# Altium schematic sheet Section B - TItle B.SchDoc
size 350 x 229 mm
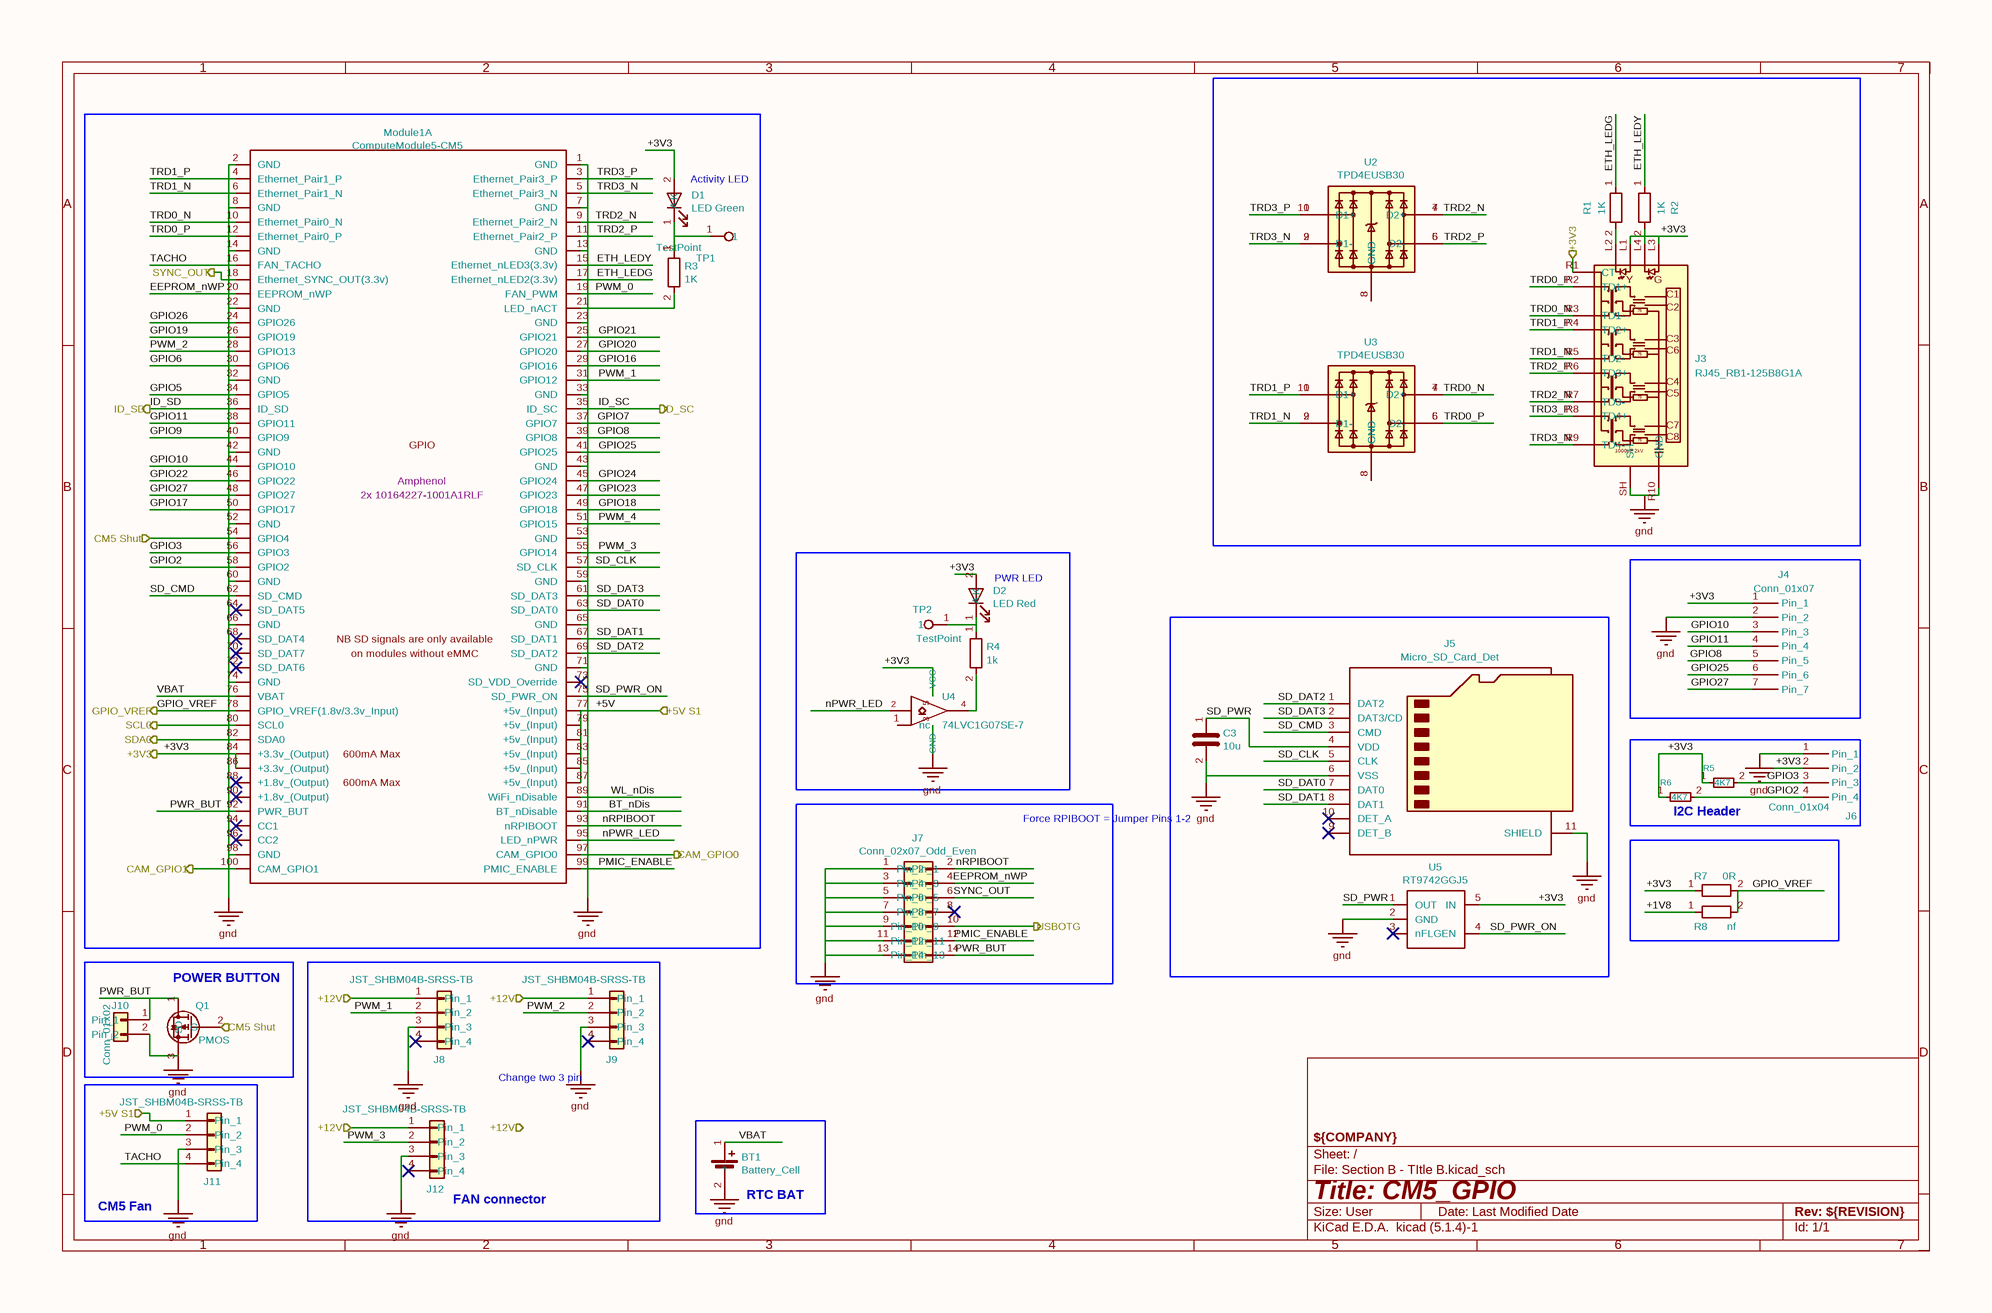
[diagram p0: Section B - TItle B.SchDoc]

## Parts
BT1  Battery_Cell  [BatteryHolder_Keystone_3034_1x20mm]
C3  10u  [C_0805_2012Metric]
D1  LED Green  [LED_0603_1608Metric]
D2  LED Red  [LED_0603_1608Metric]
J3  RJ45_RB1-125B8G1A  [RJ45_UDE_RB1-125B8G1A]
J4  Conn_01x07  [JST_GH_SM07B-GHS-TB_1x07-1MP_P1.25mm_Horizontal]
J5  Micro_SD_Card_Det  [DM3ATSFPEJM5]
J6  Conn_01x04  [SPARKFUN_PRT-14417]
J7  Conn_02x07_Odd_Even  [PinHeader_2x07_P2.54mm_Vertical]
J8  JST_SHBM04B-SRSS-TB  [JST_SH_BM04B-SRSS-TB_1x04-1MP_P1.00mm_Vertical]
J9  JST_SHBM04B-SRSS-TB  [JST_SH_BM04B-SRSS-TB_1x04-1MP_P1.00mm_Vertical]
J10  Conn_01x02  [JST_GH_BM02B-GHS-TBT_1x02-1MP_P1.25mm_Vertical]
J11  JST_SHBM04B-SRSS-TB  [JST_SH_BM04B-SRSS-TB_1x04-1MP_P1.00mm_Vertical]
J12  JST_SHBM04B-SRSS-TB  [JST_SH_BM04B-SRSS-TB_1x04-1MP_P1.00mm_Vertical]
Module1  Field4: Amphenol  Field5: 2x 10164227-1001A1RLF  [Raspberry-Pi-5-Compute-Module]  (hidden comment: ComputeModule5-CM5)  (part A of 2)
Q1  PMOS  [BSS84AKW115]
R1  1K  [R_0603_1608Metric]
R2  1K  [R_0603_1608Metric]
R3  1K  [R_0603_1608Metric]
R4  1k  [R_0603_1608Metric]
R5  4K7  [R_0603_1608Metric]
R6  4K7  [R_0603_1608Metric]
R7  0R  [R_0805_2012Metric_Pad1.20x1.40mm_HandSolder]
R8  nf  [R_0805_2012Metric_Pad1.20x1.40mm_HandSolder]
TP1  TestPoint  [TestPoint_Pad_1.0x1.0mm]
TP2  TestPoint  [TestPoint_Pad_1.0x1.0mm]
U2  TPD4EUSB30  [USON-10_2.5x1.0mm_P0.5mm]
U3  TPD4EUSB30  [USON-10_2.5x1.0mm_P0.5mm]
U4  74LVC1G07SE-7  [SOT-353_SC-70-5]
U5  RT9742GGJ5  [SOT-23-5]

## Blocks framed on the sheet
Activity LED: D1 Module1 R3 TP1
PWR LED: D2 R4 TP2 U4
I2C Header /: J6 R5 R6
Force RPIBOOT = Jumper Pins 1-2 /: J7
POWER BUTTON: J10 Q1
FAN connector /: J8 J9 J12
CM5 Fan /: J11
RTC BAT: BT1

## Ports
+3V3 (in), +3V3 (out), +5V S1 (in), +12V (in), CAM_GPIO0 (out), CAM_GPIO1 (out), CM5 Shut (in), GPIO_VREF (out), ID_SC (out), ID_SD (out), SCL0 (out), SDA0 (out), SYNC_OUT (out), USBOTG (out)

## Nets
gnd: BT1.2(-) C3.2 J3.R10(GND) J3.SH J4.2(Pin_2) J5.6(VSS) J5.11(SHIELD) J6.1(Pin_1) J7.1(Pin_1) J7.3(Pin_3) J7.5(Pin_5) J7.7(Pin_7) J7.9(Pin_9) J7.11(Pin_11) J7.13(Pin_13) J8.3(Pin_3) J9.3(Pin_3) J10.2(Pin_2) J11.3(Pin_3) J12.3(Pin_3) Module1.1(GND) Module1.2(GND) Module1.7(GND) Module1.8(GND) Module1.13(GND) Module1.14(GND) Module1.22(GND) Module1.23(GND) Module1.32(GND) Module1.33(GND) Module1.42(GND) Module1.43(GND) Module1.52(GND) Module1.53(GND) Module1.59(GND) Module1.60(GND) Module1.65(GND) Module1.66(GND) Module1.71(GND) Module1.74(GND) Module1.98(GND) Q1.3(S) U4.3(GND) U5.2(GND)
+1V8: R8.1
+3V3: D1.2(A) D2.2(A) J3.L1 J3.L3 J3.R1(CT) J4.1(Pin_1) J6.2(Pin_2) Module1.84(+3.3v_(Output)) Module1.86(+3.3v_(Output)) R5.1 R6.1 R7.1 U4.5(VCC) U5.5(IN) ; port +3V3
+5V: J11.1(Pin_1) Module1.77(+5v_(Input)) Module1.79(+5v_(Input)) Module1.81(+5v_(Input)) Module1.83(+5v_(Input)) Module1.85(+5v_(Input)) Module1.87(+5v_(Input)) ; port +5V S1
+12V: J8.1(Pin_1) J9.1(Pin_1) J12.1(Pin_1) ; port +12V
BT_nDis: Module1.91(BT_nDisable)
CAM_GPIO0: Module1.97(CAM_GPIO0) ; port CAM_GPIO0
CAM_GPIO1: Module1.100(CAM_GPIO1) ; port CAM_GPIO1
CM5 Shut: Module1.54(GPIO4) Q1.2(G) ; port CM5 Shut
EEPROM_nWP: J7.4(Pin_4) Module1.20(EEPROM_nWP)
ETH_LEDG: Module1.17(Ethernet_nLED2(3.3v)) R1.1
ETH_LEDY: Module1.15(Ethernet_nLED3(3.3v)) R2.1
GPIO2: J6.4(Pin_4) Module1.58(GPIO2) R6.2
GPIO3: J6.3(Pin_3) Module1.56(GPIO3) R5.2
GPIO5: Module1.34(GPIO5)
GPIO6: Module1.30(GPIO6)
GPIO7: Module1.37(GPIO7)
GPIO8: J4.5(Pin_5) Module1.39(GPIO8)
GPIO9: Module1.40(GPIO9)
GPIO10: J4.3(Pin_3) Module1.44(GPIO10)
GPIO11: J4.4(Pin_4) Module1.38(GPIO11)
GPIO16: Module1.29(GPIO16)
GPIO17: Module1.50(GPIO17)
GPIO18: Module1.49(GPIO18)
GPIO19: Module1.26(GPIO19)
GPIO20: Module1.27(GPIO20)
GPIO21: Module1.25(GPIO21)
GPIO22: Module1.46(GPIO22)
GPIO23: Module1.47(GPIO23)
GPIO24: Module1.45(GPIO24)
GPIO25: J4.6(Pin_6) Module1.41(GPIO25)
GPIO26: Module1.24(GPIO26)
GPIO27: J4.7(Pin_7) Module1.48(GPIO27)
GPIO_VREF: Module1.78(GPIO_VREF(1.8v/3.3v_Input)) R7.2 R8.2 ; port GPIO_VREF
ID_SC: Module1.35(ID_SC) ; port ID_SC
ID_SD: Module1.36(ID_SD) ; port ID_SD
nPWR_LED: Module1.95(LED_nPWR) U4.2
nRPIBOOT: J7.2(Pin_2) Module1.93(nRPIBOOT)
PMIC_ENABLE: J7.12(Pin_12) Module1.99(PMIC_ENABLE)
PWM_0: J11.2(Pin_2) Module1.19(FAN_PWM)
PWM_1: J8.2(Pin_2) Module1.31(GPIO12)
PWM_2: J9.2(Pin_2) Module1.28(GPIO13)
PWM_3: J12.2(Pin_2) Module1.55(GPIO14)
PWM_4: Module1.51(GPIO15)
PWR_BUT: J7.14(Pin_14) J10.1(Pin_1) Module1.92(PWR_BUT) Q1.1(D)
SCL0: Module1.80(SCL0) ; port SCL0
SD_CLK: J5.5(CLK) Module1.57(SD_CLK)
SD_CMD: J5.3(CMD) Module1.62(SD_CMD)
SD_DAT0: J5.7(DAT0) Module1.63(SD_DAT0)
SD_DAT1: J5.8(DAT1) Module1.67(SD_DAT1)
SD_DAT2: J5.1(DAT2) Module1.69(SD_DAT2)
SD_DAT3: J5.2(DAT3/CD) Module1.61(SD_DAT3)
SD_PWR: C3.1 J5.4(VDD) U5.1(OUT)
SD_PWR_ON: Module1.75(SD_PWR_ON) U5.4(EN)
SDA0: Module1.82(SDA0) ; port SDA0
SYNC_OUT: J7.6(Pin_6)
SYNC_OUT: Module1.18(Ethernet_SYNC_OUT(3.3v)) ; port SYNC_OUT  [a separate net that carries the same name]
TACHO: J11.4(Pin_4) Module1.16(FAN_TACHO)
TRD0_N: J3.R3(TD1-) Module1.10(Ethernet_Pair0_N) U3.4(D2+) U3.7
TRD0_P: J3.R2(TD1+) Module1.12(Ethernet_Pair0_P) U3.5(D2-) U3.6
TRD1_N: J3.R5(TD2-) Module1.6(Ethernet_Pair1_N) U3.2(D1-) U3.9
TRD1_P: J3.R4(TD2+) Module1.4(Ethernet_Pair1_P) U3.1(D1+) U3.10
TRD2_N: J3.R7(TD3-) Module1.9(Ethernet_Pair2_N) U2.4(D2+) U2.7
TRD2_P: J3.R6(TD3+) Module1.11(Ethernet_Pair2_P) U2.5(D2-) U2.6
TRD3_N: J3.R9(TD4-) Module1.5(Ethernet_Pair3_N) U2.2(D1-) U2.9
TRD3_P: J3.R8(TD4+) Module1.3(Ethernet_Pair3_P) U2.1(D1+) U2.10
USBOTG: J7.10(Pin_10) ; port USBOTG
VBAT: BT1.1(+) Module1.76(VBAT)
WL_nDis: Module1.89(WiFi_nDisable)
NetD1_1: D1.1(K) R3.1 TP1.1
NetD2_1: D2.1(K) R4.1 TP2.1
NetJ3_L2: J3.L2 R1.2
NetJ3_L4: J3.L4 R2.2
NetModule1_21: Module1.21(LED_nACT) R3.2
NetR4_2: R4.2 U4.4
NetU2_3: U2.3(GND) U2.8(GND)
NetU3_3: U3.3(GND) U3.8(GND)

Not connected (* = marked no-connect by the designer): J5 9(DET_B)* 10(DET_A)*; J7 8(Pin_8)*; J8 4(Pin_4)*; J9 4(Pin_4)*; J12 4(Pin_4)*; Module1 64(SD_DAT5)* 68(SD_DAT4)* 70(SD_DAT7)* 72(SD_DAT6)* 73(SD_VDD_Override)* 88(+1.8v_(Output))* 90(+1.8v_(Output))* 94(CC1)* 96(CC2)*; U4 1(nc); U5 3(nFLG)*

## Notes on the sheet
- (near J9) Change two 3 pin
- 1
- 2
- 3
- 4
- 5
- 6
- 7
- A
- B
- C
- D
- Title: CM5_GPIO
- File: Section B - TItle B.kicad_sch
- Sheet: /
- ${COMPANY}
- KiCad E.D.A.  kicad (5.1.4)-1
- Size: User
- Date: Last Modified Date
- Rev: ${REVISION}
- Id: 1/1
- (in symbol ComputeModule5-CM5, part A) GPIO; NB SD signals are only available; on modules without eMMC; 600mA Max
- (in symbol RJ45_RB1-125B8G1A) Y; G; C1; 75; C2; C3; C6; C4; C5; C7; C8; 1000pF 2kV

## Library data of the parts
BT1 = Battery_Cell: Part Description: Battery Retainer Coin, 20.0mm 1 Cell SMD (SMT) Tab; Field4: Digikey; Field5: 36-3034-ND; Field6: 3034; Field7: Keystone; Value: Battery_Cell; Footprint: Battery:BatteryHolder_Keystone_3034_1x20mm
C3 = C: Part Description: 10uF 10% 10V Ceramic Capacitor X7R 0805 (2012 Metric); Field5: 490-14381-1-ND; Field4: Digikey; Field6: GRM21BR71A106KA73L; Field7: Murata; Field8: 111893011; Value: 10u; Footprint: Capacitor_SMD:C_0805_2012Metric
D1 = LED: Part Description: Green 572nm LED Indication - Discrete 2.2V 2-SMD, No Lead; Field4: Digikey; Field5: LTST-S270KGKT; Field6: SML-A12M8TT86N; Field7: Rohm; Field8: 650263301; Value: LED Green; Footprint: LED_SMD:LED_0603_1608Metric
D2 = LED_1: Part Description: Red 620nm LED Indication - Discrete 2.2V 2-SMD, No Lead; Field4: Digikey; Field5: LTST-S270KRKT; Field6: SML-A12U8TT86Q; Field7: Rohm; Field8: 650295101; Value: LED Red; Footprint: LED_SMD:LED_0603_1608Metric
J3 = RJ45_RB1-125B8G1A: Description: LAN Transformer Jack, RJ45, 10/100/1000 BaseT; Value: RJ45_RB1-125B8G1A; Footprint: Connector_RJ:RJ45_UDE_RB1-125B8G1A
J4 = Conn_01x07_Socket: Description: Generic connector, single row, 01x07, script generated; Value: Conn_01x07; Footprint: Connector_JST:JST_GH_SM07B-GHS-TB_1x07-1MP_P1.25mm_Horizontal
J5 = Micro_SD_Card_Det2: Part Description: 9 (8 + 1) Position Card Connector microSD™ Surface Mount, Right Angle Gold; Field4: Farnell; Field5: 2358234; Field6: 503398-1892; Field7: Molex; Field8: UCON00512; Value: Micro_SD_Card_Det; Footprint: DM3AT-SF-PEJM5:DM3ATSFPEJM5
J6 = Conn_01x04_Socket: Description: Generic connector, single row, 01x04, script generated; Value: Conn_01x04; Footprint: PRT-14417:SPARKFUN_PRT-14417
J7 = Conn_02x07_Odd_Even: Field4: Toby; Field5: THD-07-R; Field6: THD-07-R; Field7: Toby; Part Description: PinHeader_2x07_P2.54mm_Vertical; Value: Conn_02x07_Odd_Even; Footprint: Connector_PinHeader_2.54mm:PinHeader_2x07_P2.54mm_Vertical
J8 J9 J11 J12 = Conn_01x04: Part Description: 4 pin vertical 1mm pitch connector; Field7: JST; Field5: SHBM04B-SRSS-TB; Field6: SHBM04B-SRSS-TB; Value: JST_SHBM04B-SRSS-TB; Footprint: Connector_JST:JST_SH_BM04B-SRSS-TB_1x04-1MP_P1.00mm_Vertical
J10 = Conn_01x02: Description: Generic connector, single row, 01x02, script generated (kicad-library-utils/schlib/autogen/connector/); Value: Conn_01x02; Footprint: Connector_JST:JST_GH_BM02B-GHS-TBT_1x02-1MP_P1.25mm_Vertical
Module1 = ComputeModule5-CM5: Part Description: 100 Position Connector Receptacle, Center Strip Contacts Surface Mount Gold; Description: RaspberryPi Compute module 5; Field7: Hirose; Field6: 2x 10164227-1001A1RLF; Value: ComputeModule5-CM5; Footprint: cm5:Raspberry-Pi-5-Compute-Module
Q1 = PMOS: Description: P-MOSFET transistor, drain/source/gate; Sim.Type: VDMOS; Sim.Pins: 1=D 2=G 3=S; Sim.Device: PMOS; Value: PMOS; Footprint: BSS84AKW115:BSS84AKW115
R1 R2 = R: Part Description: Resistor 470R M1005 1% 63mW; Field4: Farnell; Field5: 9239197; Field7: KOA EUROPE GMBH; Field6: RK73G1ETQTP4700D; Field8: 120887981; Value: 1K; Footprint: Resistor_SMD:R_0603_1608Metric
R3 R4 = R: Part Description: Resistor 1K M1005 1% 63mW; Field4: Farnell; Field5: 9239235; Field7: KOA EUROPE GMBH; Field6: RK73H1ETTP1001F; Field8: 125049511; Footprint: Resistor_SMD:R_0603_1608Metric
  R3: Value: 1K
  R4: Value: 1k
R5 R6 = R_Small: Description: Resistor, small symbol; Value: 4K7; Footprint: Resistor_SMD:R_0603_1608Metric
R7 = R: Part Description: Resistor 0R M2012 5%; Field4: Farnell; Field5: 9233750; Field7: Rohm; Field6: MCR10EZPJ000; Field8: 121629591; Value: 0R; Footprint: Resistor_SMD:R_0805_2012Metric_Pad1.20x1.40mm_HandSolder
R8 = R: Field4: nf; Field5: nf; Field6: nf; Value: nf; Footprint: Resistor_SMD:R_0805_2012Metric_Pad1.20x1.40mm_HandSolder
TP1 TP2 = TestPoint: Field4: nf; Field5: nf; Field6: nf; Field7: nf; Part Description: Test point; Value: TestPoint; Footprint: TestPoint:TestPoint_Pad_1.0x1.0mm
U2 U3 = TPD4EUSB30: Part Description: Quad TVS diode for high speed signals (USB3, GigE etc.); Field4: Farnell; Field5: 2335455; Field6: CDDFN10-3324P-13; Field7: Bourns; Field8: UDIO00346; Value: TPD4EUSB30; Footprint: Package_SON:USON-10_2.5x1.0mm_P0.5mm
U4 = 74LVC1G07_copy: Part Description: Buffer, Non-Inverting 1 Element 1 Bit per Element Open Drain Output SOT-353; Field4: Farnell; Field5: 2425492; Field7: Diodes; Field6: 74LVC1G07SE-7; Value: 74LVC1G07SE-7; Footprint: Package_TO_SOT_SMD:SOT-353_SC-70-5
U5 = RT9742GGJ5: Part Description: Power Switch/Driver 1:1 N-Channel 1A TSOT-23-5; Field4: Farnell; Field5: 2545875; Field7: RichTek; Field8: USWI00166; Field6: RT9742GGJ5; Value: RT9742GGJ5; Footprint: Package_TO_SOT_SMD:SOT-23-5